# Altium schematic sheet 1_PWR.schdoc
size 210 x 148 mm; Symbol: tv_muban1_1; Company: 嘉立创EDA; Version: V1.0; Page Size: A4; @Project Name: LCEDAsucaiku; @Update Date: 2026-05-01; @Create Date: 2026-03-27; @Page Name: PWR; @Page Count: 8; @Page No: 1; @Update Time: 18:37:05; Color: #990000; Device: sucai_muban; @Board Name: tv基板; @Create Time: 22:33:50; @Schematic Name: Schematic1; @Assembly Variant: Basic; Border: 1; Title Block Position: 3; Size: A4; Width: 826; Height: 582; Region Start: 1; X Region Count: 6; Y Region Count: 4; Blade Width: 10; SheetNumber: 1; SheetTotal: 8
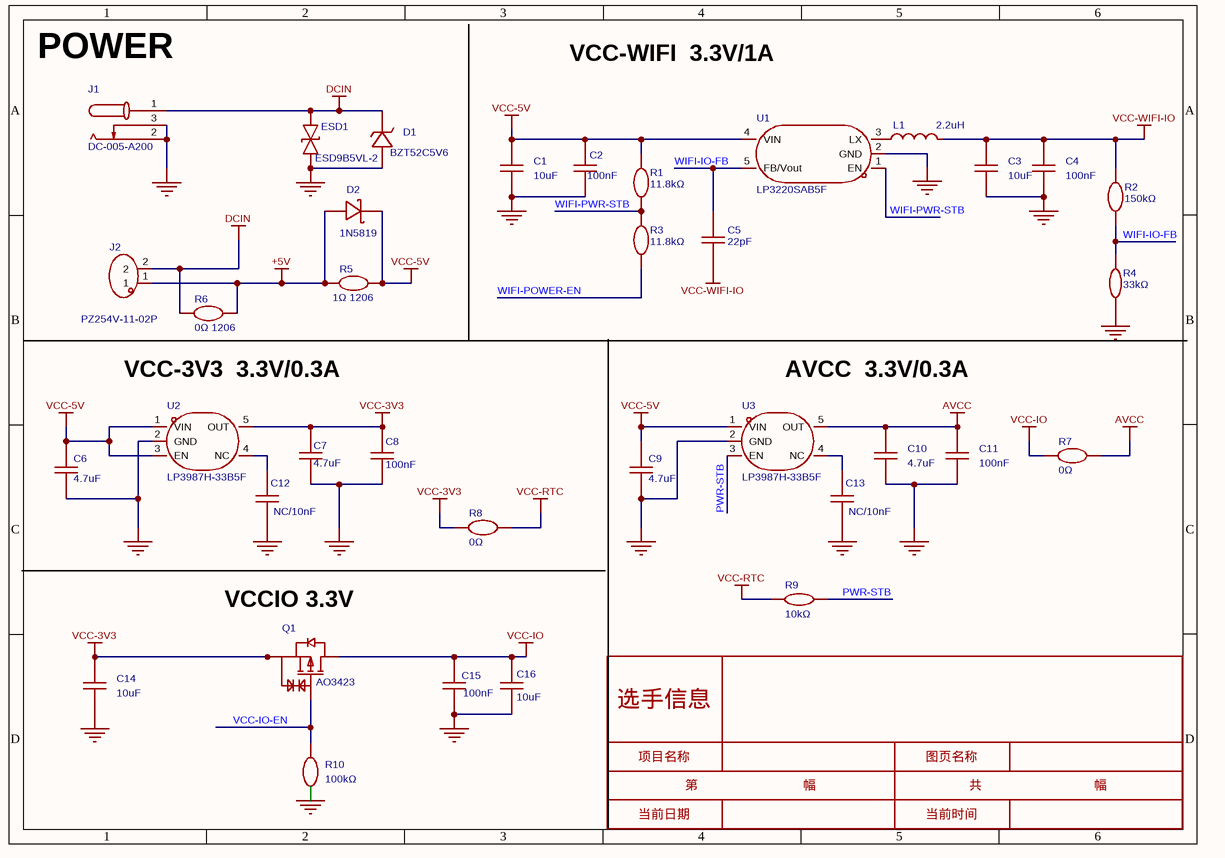
[diagram p0: 1_PWR.schdoc]

## Parts
C1  10uF  [C0805]
C2  100nF  [C0402]
C3  10uF  [C0805]
C4  100nF  [C0402]
C5  22pF  [C0402]
C6  4.7uF  [C0402]
C7  4.7uF  [C0402]
C8  100nF  [C0402]
C9  4.7uF  [C0402]
C10  4.7uF  [C0402]
C11  100nF  [C0402]
C12  NC/10nF  [C0402]
C13  NC/10nF  [C0402]
C14  10uF  [C0805]
C15  100nF  [C0402]
C16  10uF  [C0805]
D1  BZT52C5V6  [SOD-123_L2.7-W1.6-LS3.7-RD]
D2  1N5819  [SMA_L4.4-W2.6-LS5.0-RD]
ESD1  ESD9B5VL-2  [DFN1006-2L-BI]
J1  DC-005-A200  [DC-IN-TH_DC-005-A200]
J2  PZ254V-11-02P  [HDR-TH_2P-P2.54-V-M]
L1  2.2uH  [IND-SMD_L4.6-W4.1_MHCI04015]
Q1  AO3423  [SOT-23-3_L2.9-W1.3-P1.90-LS2.4-BR-3]
R1  11.8kΩ  [R0402]
R2  150kΩ  [R0402]
R3  11.8kΩ  [R0402]
R4  33kΩ  [R0402]
R5  1Ω 1206  [R1206]
R6  0Ω 1206  [R1206]
R7  0Ω  [R0402]
R8  0Ω  [R0402]
R9  10kΩ  [R0402]
R10  100kΩ  [R0402]
U1  LP3220SAB5F  [SOT-23-5_L3.0-W1.7-P0.95-LS2.8-BR]
U2  LP3987H-33B5F  [SOT-23-5_L3.0-W1.7-P0.95-LS2.8-BL]
U3  LP3987H-33B5F  [SOT-23-5_L3.0-W1.7-P0.95-LS2.8-BL]

## Nets
+5V: D2.2(A) J2.1 R5.1 R6.2
AVCC: C10.2 C11.2 R7.2 U3.5(OUT)
DCIN: D1.1(K) ESD1.2 J1.1 J2.2 R6.1
GND: C1.1 C2.1 C3.1 C4.1 C6.1 C7.1 C8.1 C9.1 C10.1 C11.1 C12.1 C13.1 C14.1 C15.1 C16.1 D1.2(A) ESD1.1 J1.2 J1.3 R4.1 R10.2 U1.2(GND) U2.2(GND) U3.2(GND)
VCC-3V3: C7.2 C8.2 C14.2 Q1.2(S) R8.1 U2.5(OUT)
VCC-5V: C1.2 C2.2 C6.2 C9.2 D2.1(C) R1.2 R5.2 U1.4(VIN) U2.1(VIN) U2.3(EN) U3.1(VIN)
VCC-IO: C15.2 C16.2 Q1.3(D) R7.1
VCC-RTC: R8.2 R9.1
VCC-WIFI-IO: C3.2 C4.2 C5.1 L1.2 R2.2
PWR-STB: R9.2 U3.3(EN)
VCC-IO-EN: Q1.1(G) R10.1
WIFI-IO-FB: C5.2 R2.1 R4.2 U1.5(FB/Vout)
WIFI-POWER-EN: R3.1
WIFI-PWR-STB: R1.1 R3.2 U1.1(EN)
NetC12_2: C12.2 U2.4(NC)
NetC13_2: C13.2 U3.4(NC)
NetL1_1: L1.1 U1.3(LX)

## Notes on the sheet
- (near J1) POWER
- VCC-WIFI  3.3V/1A
- VCC-3V3  3.3V/0.3A
- AVCC  3.3V/0.3A
- (near Q1) VCCIO 3.3V
- 选手信息
- 项目名称
- 第                              幅
- 图页名称
- 共                                幅
- 当前日期
- 当前时间

## Library data of the parts
C1 C3 = CGA0805X5R106K500MT: 容值:10uF;精度:±10%;额定电压:50V;温度系数:X5R;; Manufacturer: HRE(芯声); 3D Model: 1ba041120af144c991958decab20d241聨0819f05c4eef4c71ace90d822a990e87; 3D Model Transform: 78.74,51.181,0,0,0,0,0,0.0005,0; Tolerance: ±10%; Voltage Rating: 50V; Temperature Coefficient: X5R; AddInBom: yes; ModelName: C0805_L2.0-W1.3-H1.3; Symbol: CGA0805X5R106K500MT; Device: CGA0805X5R106K500MT; LCSC Part Name: 10uF ±10% 50V; Supplier Part: C6119889; Manufacturer Part: CGA0805X5R106K500MT; Supplier Footprint: 0805; JLCPCB Part Class: Extended Part; Datasheet: https://item.szlcsc.com/datasheet/CGA0805X5R106K500MT/7062595.html; Supplier: LCSC; Value: 10uF; ConvertToPcb: yes; FootprintName: C0805
C2 C4 = CL05B104KO5NNNC: 容值:100nF;精度:±10%;额定电压:16V;温度系数:X7R;; Manufacturer: SAMSUNG(三星); 3D Model: 36a51122f27c49738f86b3bfa98863e0聨0819f05c4eef4c71ace90d822a990e87; 3D Model Transform: 39.37,19.685,0,0,0,0,0,0,0; Tolerance: ±10%; Voltage Rating: 16V; Temperature Coefficient: X7R; AddInBom: yes; ModelName: C0402_L1.0-W0.5-H0.5; Symbol: CL05B104KO5NNNC; Device: CL05B104KO5NNNC; LCSC Part Name: 100nF ±10% 16V; Supplier Part: C1525; Manufacturer Part: CL05B104KO5NNNC; Supplier Footprint: 0402; JLCPCB Part Class: Basic Part; Datasheet: https://item.szlcsc.com/datasheet/CL05B104KO5NNNC/1877.html; Supplier: LCSC; Value: 100nF; ConvertToPcb: yes; FootprintName: C0402
C5 = FCC0402N220J500AT: 容值:22pF;精度:±5%;额定电压:50V;温度系数:C0G;; Manufacturer: FOJAN(富捷); 3D Model: 36a51122f27c49738f86b3bfa98863e0聨0819f05c4eef4c71ace90d822a990e87; 3D Model Transform: 39.37,19.685,0,0,0,0,0,0,0; Tolerance: ±5%; Voltage Rating: 50V; Temperature Coefficient: C0G; AddInBom: yes; ModelName: C0402_L1.0-W0.5-H0.5; Symbol: FCC0402N220J500AT; Device: FCC0402N220J500AT; LCSC Part Name: 22pF ±5% 50V; Supplier Part: C5137569; Manufacturer Part: FCC0402N220J500AT; Supplier Footprint: 0402; JLCPCB Part Class: Extended Part; Datasheet: https://item.szlcsc.com/datasheet/FCC0402N220J500AT/5747021.html; Supplier: LCSC; Value: 22pF; ConvertToPcb: yes; FootprintName: C0402
C6 C7 C9 C10 = GRM155C61E475ME15D: 容值:4.7uF;精度:±20%;额定电压:25V;温度系数:-;; Manufacturer: muRata(村田); AddInBom: yes; ModelId: 36a51122f27c49738f86b3bfa98863e0聨0819f05c4eef4c71ace90d822a990e87; ModelName: C0402_L1.0-W0.5-H0.5; ModelTransform: 39.37,19.685,0,0,0,0,0,0,0; Tolerance: ±20%; Voltage Rating: 25V; Symbol: GRM155C61E475ME15D; Device: GRM155C61E475ME15D; LCSC Part Name: 4.7uF ±20% 25V; SupplierPart: C5718966; ManufacturerPart: GRM155C61E475ME15D; Supplier Footprint: 0402; JLCPCB Part Class: Extended Part; Datasheet: https://item.szlcsc.com/datasheet/GRM155C61E475ME15D/6643118.html; Supplier: LCSC; ConvertToPcb: yes; FootprintName: C0402; Value: 4.7uF; Temperature Coefficient: -
C8 C11-C13 C15 = CL05B104KO5NNNC: 容值:100nF;精度:±10%;额定电压:16V;温度系数:X7R;; Manufacturer: SAMSUNG(三星); AddInBom: yes; ModelId: 36a51122f27c49738f86b3bfa98863e0聨0819f05c4eef4c71ace90d822a990e87; ModelName: C0402_L1.0-W0.5-H0.5; ModelTransform: 39.37,19.685,0,0,0,0,0,0,0; Tolerance: ±10%; Voltage Rating: 16V; Temperature Coefficient: X7R; Symbol: CL05B104KO5NNNC; Device: CL05B104KO5NNNC; LCSC Part Name: 100nF ±10% 16V; ManufacturerPart: CL05B104KO5NNNC; Supplier Footprint: 0402; JLCPCB Part Class: Basic Part; Datasheet: https://item.szlcsc.com/datasheet/CL05B104KO5NNNC/1877.html; Supplier: LCSC; ConvertToPcb: yes; FootprintName: C0402
  C8 C11 C15: SupplierPart: C1525; Value: 100nF
  C12 C13: Value: NC/10nF
C14 C16 = CGA0805X5R106K500MT: 容值:10uF;精度:±10%;额定电压:50V;温度系数:X5R;; Manufacturer: HRE(芯声); AddInBom: yes; ModelId: 1ba041120af144c991958decab20d241聨0819f05c4eef4c71ace90d822a990e87; ModelName: C0805_L2.0-W1.3-H1.3; ModelTransform: 78.74,51.181,0,0,0,0,0,0.0005,0; Tolerance: ±10%; Voltage Rating: 50V; Temperature Coefficient: X5R; Symbol: CGA0805X5R106K500MT; Device: CGA0805X5R106K500MT; LCSC Part Name: 10uF ±10% 50V; SupplierPart: C6119889; ManufacturerPart: CGA0805X5R106K500MT; Supplier Footprint: 0805; JLCPCB Part Class: Extended Part; Datasheet: https://item.szlcsc.com/datasheet/CGA0805X5R106K500MT/7062595.html; Supplier: LCSC; ConvertToPcb: yes; FootprintName: C0805; Value: 10uF
D1 = BZT52C5V6_C19077402: 二极管配置:独立式;稳压值(标称值):5.6V;稳压值(范围):5.32V~5.88V;耗散功率(Pd):350mW;; Manufacturer: R+O(宏嘉诚); AddInBom: yes; ModelId: ad7e39f9e5534b3c96ffdc5532ebb493聨0819f05c4eef4c71ace90d822a990e87; ModelName: SOD-123_L2.7-W1.6-H1.4-LS3.7; ModelTransform: 146.026,62.992,0,180,0,0,0.0005,0,0; Diode Configuration: 独立式; Zener Voltage(Nom): 5.6V; Reverse Leakage Current (Ir): 1uA@2.0V; Pd - Power Dissipation: 350mW; Impedance(Zzt): 40Ω; Impedance(Zzk): 400Ω; Operating Junction Temperature Range: -55℃~+150℃; Symbol: BZT52C5V6_C19077402; Device: BZT52C5V6_C19077402; LCSC Part Name: 表面贴装齐纳二极管; SupplierPart: C19077402; ManufacturerPart: BZT52C5V6; Supplier Footprint: SOD-123; JLCPCB Part Class: Extended Part; Datasheet: https://item.szlcsc.com/datasheet/BZT52C5V6/20275487.html; Supplier: LCSC; ConvertToPcb: yes; FootprintName: SOD-123_L2.7-W1.6-LS3.7-RD; Zener Voltage(Range): 5.32V~5.88V
D2 = 1N5819_C437199: 正向压降(Vf):500mV@1A;直流反向耐压(Vr):40V;整流电流:1A;; Manufacturer: KEXIN(科信); AddInBom: yes; ModelId: a2d22152f8d5421c8e96dbd56af7c345聨0819f05c4eef4c71ace90d822a990e87; ModelTransform: 204.724,98.425,0,0,0,0,0,0,0; Voltage - DC Reverse(Vr): 40V; Current - Rectified: 1A; Operating Junction Temperature Range: -60℃~+125℃; Non-Repetitive Peak Forward Surge Current: 40A; Symbol: 1N5819_C437199; Device: 1N5819_C437199; LCSC Part Name: KEXIN(科信)原型号 SS14,后续变更为 1N5819，丝印不变。 电压:40V 电流:1A; SupplierPart: C437199; ManufacturerPart: 1N5819; Supplier Footprint: DO-214AC(SMA); JLCPCB Part Class: Extended Part; Datasheet: https://item.szlcsc.com/datasheet/1N5819/435098.html; Supplier: LCSC; ConvertToPcb: yes; FootprintName: SMA_L4.4-W2.6-LS5.0-RD; ModelName: SMA_L4.4-W2.6-LS5.0-RD; Voltage - Forward(Vf@If): 500mV@1A
ESD1 = ESD9B5VL-2: 反向截止电压(Vrwm):5V;钳位电压:12.5V;峰值脉冲功率(Ppp):80W@8/20us;击穿电压:6V;; Manufacturer: Leiditech(雷卯电子); AddInBom: yes; ModelId: 2bdbcca3b35b49c5a8ae725a08658930聨0819f05c4eef4c71ace90d822a990e87; ModelTransform: 40.1574,24.4094,0,0,0,0,0,0,0; Reverse Stand-Off Voltage (Vrwm): 5V; Clamping Voltage: 12.5V; Voltage - Breakdown: 6V; Reverse Leakage Current (Ir): 500nA; level of protection: IEC 61000-4-5；IEC 61000-4-2; Junction Capacitance: 15pF; Symbol: ESD9B5VL-2; Device: ESD9B5VL-2; Manufacturer Part: ESD9B5VL-2; LCSC Part Name: ESD 5V截止; SupplierPart: C5144823; Supplier Footprint: DFN1006-2; JLCPCB Part Class: Extended Part; Datasheet: https://item.szlcsc.com/datasheet/ESD9B5VL-2/5766708.html; Supplier: LCSC; ConvertToPcb: yes; FootprintName: DFN1006-2L-BI; ModelName: DFN1006-2L-BI; Peak Pulse Power Dissipation (Ppp): 80W@8/20us; Type: ESD
J1 = DC-005-A200: 连接器类型:DC电源插座;安装方式:弯插;触点内径:2mm;触点外径:6.4mm;额定电流:3A;额定电压:30V;工作温度:-20℃~+70℃;; Manufacturer: XUNPU(讯普); AddInBom: yes; ModelId: 1321cdbe1dc84555a9684967491c8670聨0819f05c4eef4c71ace90d822a990e87; ModelTransform: 553.149,368.14887,0,0,0,0,-137.795,85.63,-161.417; Connector Type: DC电源插座; Inside Contact Diameter: 2mm; Outside Contact Diameter: 6.4mm; Current Rating: 3A; Voltage Rating (Max): 30V; Symbol: DC-005-A200; Device: DC-005-A200; LCSC Part Name: DC电源插座 内径:2mm 外径:6.4mm; SupplierPart: C720557; ManufacturerPart: DC-005-A200; Supplier Footprint: 插件; JLCPCB Part Class: Extended Part; Datasheet: https://item.szlcsc.com/datasheet/DC-005-A200/763564.html; Supplier: LCSC; ConvertToPcb: yes; FootprintName: DC-IN-TH_DC-005-A200; ModelName: DC-IN-TH_DC-005-A200; Mounting Type: 弯插; Operating Temperature: -20℃~+70℃
J2 = PZ254V-11-02P: 插针结构:1x2P;间距:2.54mm;行距:-;圆针/方针:方针;安装方式:直插;排数:单排;总PIN位数:2P;额定电流:3A;额定电压:250V;配合针长度:6mm;塑高:2.5mm;端接针长度:3mm;触头材质:黄铜;触头镀层:-;工作温度:-40℃~+105℃;颜色:黑色;; Manufacturer: XFCN(兴飞); AddInBom: yes; ModelId: e35305ec3aa84b66b849f914b715e73f聨0819f05c4eef4c71ace90d822a990e87; ModelName: HDR2.54-M-LI-1X2P; ModelTransform: 200,100,0,0,0,0,0,0,-118.11; Pin Structure: 1x2P; Pitch: 2.54mm; Circluar Pins/Square Pins: 方针; Current Rating: 3A; Voltage Rating (Max): 250V; Symbol: PZ254V-11-02P; Device: PZ254V-11-02P; LCSC Part Name: 1x2P 间距:2.54mm 方针 直插; SupplierPart: C492401; ManufacturerPart: PZ254V-11-02P; Supplier Footprint: 插件,P=2.54mm; JLCPCB Part Class: Extended Part; Datasheet: https://item.szlcsc.com/datasheet/PZ254V-11-02P/502957.html; Supplier: LCSC; ConvertToPcb: yes; FootprintName: HDR-TH_2P-P2.54-V-M; Row Spacing: -; Mounting Type: 直插; Number of Rows: 单排; Number of Pins: 2P; Length of Mating Pin: 6mm; Insulation Height: 2.5mm; Length of End Connection Pin: 3mm; Contact Material: 黄铜; Contact Plating: -; Operating Temperature: -40℃~+105℃; Color: 黑色
L1 = SRG0420-2R2-M: 电感值:2.2uH;精度:±20%;额定电流:4A;饱和电流(Isat):5A;类型:一体成型电感;; Manufacturer: JIERR(捷而瑞); Tolerance: ±20%; Current Rating: 4A; Current - Saturation(Isat): 5A; DC Resistance(DCR): 49mΩ; Type: 一体成型电感; AddInBom: yes; Symbol: SRG0420-2R2-M; Device: SRG0420-2R2-M; LCSC Part Name: 2.2μH ±20% 5A; Supplier Part: C53462916; Manufacturer Part: SRG0420-2R2-M; Supplier Footprint: SMD,4.6x4.1mm; JLCPCB Part Class: Extended Part; Datasheet: https://item.szlcsc.com/datasheet/SRG0420-2R2-M/56628161.html; Supplier: LCSC; Value: 2.2uH; ConvertToPcb: yes; FootprintName: IND-SMD_L4.6-W4.1_MHCI04015
Q1 = AO3423_C19268144: 漏源电压(Vdss):20V;连续漏极电流(Id):3A;导通电阻(RDS(on)@Vgs,Id):125mΩ@2.5V,2A;功率(Pd):1.55W;阈值电压(Vgs(th)@Id):1.1V@3A;; Manufacturer: TECH PUBLIC(台舟); AddInBom: yes; ModelId: c62791f0466c4ae2a892c056b845b0ca聨0819f05c4eef4c71ace90d822a990e87; ModelName: SOT-23-3P_L2.9-W1.3-H1.0-LS2.4-P0.95; ModelTransform: 98.425,114.173,0,180,0,0,0.0005,-0.0005,0; Drain Source Voltage (Vdss): 20V; Continuous Drain Current (Id): 3A; Power Dissipation (Pd): 1.55W; Input Capacitance (Ciss@Vds): 520pF@16V; Reverse Transfer Capacitance (Crss@Vds): 80pF@16V; Symbol: AO3423_C19268144; Device: AO3423_C19268144; LCSC Part Name: 耐压:20V 电流:3A; SupplierPart: C19268144; ManufacturerPart: AO3423; Supplier Footprint: SOT-23; JLCPCB Part Class: Extended Part; Datasheet: https://atta.szlcsc.com/upload/public/pdf/source/20231201/DEC71D908761248026A69CF2D48D0084.pdf; Supplier: LCSC; ConvertToPcb: yes; FootprintName: SOT-23-3_L2.9-W1.3-P1.90-LS2.4-BR-3; Drain Source On Resistance (RDS(on)@Vgs,Id): 125mΩ@2.5V,2A; Gate Threshold Voltage (Vgs(th)@Id): 1.1V@3A; Operating Temperature: -55℃~+150℃
R1 R3 = FRC0402F1182TS: 电阻类型:厚膜电阻;阻值:11.8kΩ;精度:±1%;功率:62.5mW;工作电压:50V;温度系数:±100ppm/℃;; Manufacturer: FOJAN(富捷); 3D Model: 98c88bc2b9094f218f3a3e30a7012738聨0819f05c4eef4c71ace90d822a990e87; 3D Model Transform: 39.37,19.685,0,0,0,0,0,0,0; Tolerance: ±1%; Power(Watts): 62.5mW; Voltage-Supply(Max): 50V; AddInBom: yes; ModelName: R0402_L1.0-W0.5-H0.4; Symbol: FRC0402F1182TS; Device: FRC0402F1182TS; LCSC Part Name: 11.8kΩ ±1% 62.5mW 厚膜电阻; Supplier Part: C2929934; Manufacturer Part: FRC0402F1182TS; Supplier Footprint: 0402; JLCPCB Part Class: Extended Part; Supplier: LCSC; Type: 厚膜电阻; Value: 11.8kΩ; Temperature Coefficient: ±100ppm/℃; Operating Temperature: -55℃~+155℃; ConvertToPcb: yes; FootprintName: R0402
R2 = FRC0402F1503TS: 电阻类型:厚膜电阻;阻值:150kΩ;精度:±1%;功率:62.5mW;工作电压:50V;温度系数:±100ppm/℃;; Manufacturer: FOJAN(富捷); 3D Model: 98c88bc2b9094f218f3a3e30a7012738聨0819f05c4eef4c71ace90d822a990e87; 3D Model Transform: 39.37,19.685,0,0,0,0,0,0,0; Tolerance: ±1%; Power(Watts): 62.5mW; Voltage-Supply(Max): 50V; AddInBom: yes; ModelName: R0402_L1.0-W0.5-H0.4; Symbol: FRC0402F1503TS; Device: FRC0402F1503TS; LCSC Part Name: 150kΩ ±1% 62.5mW 厚膜电阻; Supplier Part: C2909320; Manufacturer Part: FRC0402F1503TS; Supplier Footprint: 0402; JLCPCB Part Class: Extended Part; Supplier: LCSC; Type: 厚膜电阻; Value: 150kΩ; Temperature Coefficient: ±100ppm/℃; Operating Temperature: -55℃~+155℃; ConvertToPcb: yes; FootprintName: R0402
R4 = 0402WGF3302TCE: 电阻类型:厚膜电阻;阻值:33kΩ;精度:±1%;功率:62.5mW;最大工作电压:50V;温度系数:±100ppm/℃;; Manufacturer: UNI-ROYAL(厚声); 3D Model: 98c88bc2b9094f218f3a3e30a7012738聨0819f05c4eef4c71ace90d822a990e87; 3D Model Transform: 39.37,19.685,0,0,0,0,0,0,0; Tolerance: ±1%; Power(Watts): 62.5mW; Overload Voltage (Max): 50V; AddInBom: yes; ModelName: R0402_L1.0-W0.5-H0.4; Symbol: 0402WGF3302TCE; Device: 0402WGF3302TCE; LCSC Part Name: 33kΩ ±1% 62.5mW 厚膜电阻; Supplier Part: C25779; Manufacturer Part: 0402WGF3302TCE; Supplier Footprint: 0402; JLCPCB Part Class: Basic Part; Datasheet: https://atta.szlcsc.com/upload/public/pdf/source/20200306/C422600_1E6D84923E4A46A82E41ADD87F860B5C.pdf; Supplier: LCSC; Type: 厚膜电阻; Value: 33kΩ; Temperature Coefficient: ±100ppm/℃; Operating Temperature Range: -55℃~+155℃; ConvertToPcb: yes; FootprintName: R0402
R5 = FRC1206J1R0 TS: 电阻类型:厚膜电阻;阻值:1Ω;精度:±5%;功率:250mW;工作电压:200V;温度系数:±200ppm/℃;; Manufacturer: FOJAN(富捷); AddInBom: yes; ModelId: 89a1f13db2384da588040e0b3c55bf66聨0819f05c4eef4c71ace90d822a990e87; ModelName: R1206_L3.2-W1.6-H0.6; ModelTransform: 125.984,62.992,0,0,0,0,0,0,0; Tolerance: ±5%; Power(Watts): 250mW; Voltage-Supply(Max): 200V; Symbol: FRC1206J1R0 TS; Device: FRC1206J1R0 TS; Value: 1Ω 1206; LCSC Part Name: 1Ω ±5% 250mW 厚膜电阻; ManufacturerPart: FRC1206J1R0 TS; Supplier Footprint: 1206; JLCPCB Part Class: Extended Part; Datasheet: https://item.szlcsc.com/datasheet/FRC1206J1R0%2520TS/3180955.html; Supplier: LCSC; ConvertToPcb: yes; FootprintName: R1206; Type: 厚膜电阻; Temperature Coefficient: ±200ppm/℃; Operating Temperature: -55℃~+155℃
R6 = FRC1206P000 TS: 电阻类型:厚膜电阻;阻值:0Ω;精度:±5%;功率:250mW;工作电压:200V;; Manufacturer: FOJAN(富捷); AddInBom: yes; ModelId: 89a1f13db2384da588040e0b3c55bf66聨0819f05c4eef4c71ace90d822a990e87; ModelName: R1206_L3.2-W1.6-H0.6; ModelTransform: 125.984,62.992,0,0,0,0,0,0,0; Tolerance: ±5%; Power(Watts): 250mW; Voltage-Supply(Max): 200V; Symbol: FRC1206P000 TS; Device: FRC1206P000 TS; Value: 0Ω 1206; LCSC Part Name: 0Ω ±5% 250mW 厚膜电阻; ManufacturerPart: FRC1206P000 TS; Supplier Footprint: 1206; JLCPCB Part Class: Extended Part; Supplier: LCSC; ConvertToPcb: yes; FootprintName: R1206; Type: 厚膜电阻; Operating Temperature: -55℃~+155℃
R7 R8 = FRC0402P000 TS: 电阻类型:厚膜电阻;阻值:0Ω;精度:±5%;功率:62.5mW;工作电压:50V;; Manufacturer: FOJAN(富捷); AddInBom: yes; ModelId: 98c88bc2b9094f218f3a3e30a7012738聨0819f05c4eef4c71ace90d822a990e87; ModelName: R0402_L1.0-W0.5-H0.4; ModelTransform: 39.37,19.685,0,0,0,0,0,0,0; Tolerance: ±5%; Power(Watts): 62.5mW; Voltage-Supply(Max): 50V; Symbol: FRC0402P000 TS; Device: FRC0402P000 TS; LCSC Part Name: 0Ω ±5% 62.5mW 厚膜电阻; SupplierPart: C2906877; ManufacturerPart: FRC0402P000 TS; Supplier Footprint: 0402; JLCPCB Part Class: Extended Part; Supplier: LCSC; ConvertToPcb: yes; FootprintName: R0402; Type: 厚膜电阻; Value: 0Ω; Operating Temperature: -55℃~+155℃
R9 = RC0402FR-0710KL: 电阻类型:厚膜电阻;阻值:10kΩ;精度:±1%;功率:62.5mW;工作电压:50V;温度系数:±100ppm/℃;; Manufacturer: YAGEO(国巨); AddInBom: yes; ModelId: 98c88bc2b9094f218f3a3e30a7012738聨0819f05c4eef4c71ace90d822a990e87; ModelName: R0402_L1.0-W0.5-H0.4; ModelTransform: 39.37,19.685,0,0,0,0,0,0,0; Tolerance: ±1%; Power(Watts): 62.5mW; Voltage-Supply(Max): 50V; Symbol: RC0402FR-0710KL; Device: RC0402FR-0710KL; LCSC Part Name: 厚膜电阻 10kΩ ±1% 62.5mW; SupplierPart: C60490; ManufacturerPart: RC0402FR-0710KL; Supplier Footprint: 0402; JLCPCB Part Class: Extended Part; Datasheet: https://item.szlcsc.com/datasheet/RC0402FR-0710KL/61542.html; Supplier: LCSC; ConvertToPcb: yes; FootprintName: R0402; Type: 厚膜电阻; Value: 10kΩ; Temperature Coefficient: ±100ppm/℃; Operating Temperature: -55℃~+155℃
R10 = RT0402BRD07100KL: 电阻类型:薄膜电阻;阻值:100kΩ;精度:±0.1%;功率:62.5mW;最大工作电压:50V;温度系数:±25ppm/℃;; Manufacturer: YAGEO(国巨); AddInBom: yes; ModelId: 98c88bc2b9094f218f3a3e30a7012738聨0819f05c4eef4c71ace90d822a990e87; ModelName: R0402_L1.0-W0.5-H0.4; ModelTransform: 39.37,19.685,0,0,0,0,0,0,0; Tolerance: ±0.1%; Power(Watts): 62.5mW; Overload Voltage (Max): 50V; Symbol: RT0402BRD07100KL; Device: RT0402BRD07100KL; LCSC Part Name: 薄膜电阻 100kΩ ±0.1% 62.5mW; SupplierPart: C852472; ManufacturerPart: RT0402BRD07100KL; Supplier Footprint: 0402; JLCPCB Part Class: Extended Part; Datasheet: https://atta.szlcsc.com/upload/public/pdf/source/20210326/C852472_6283D268A9C33EA67274729CC55E28B1.pdf; Supplier: LCSC; ConvertToPcb: yes; FootprintName: R0402; Type: 薄膜电阻; Value: 100kΩ; Temperature Coefficient: ±25ppm/℃; Operating Temperature Range: -55℃~+155℃
U1 = LP3220SAB5F: 功能类型:降压型;工作电压:2.2V~5.5V;输出电压:610mV~5.5V;输出电流:1A;输出类型:可调;; Manufacturer: LOWPOWER(微源半导体); 3D Model: 0a2a1b8f50944f73965918ad6e5fe167聨0819f05c4eef4c71ace90d822a990e87; 3D Model Transform: 114.173,109.636,0,180,0,0,0,0,0; Function: 降压型; Output Current: 1A; Frequency - Switching: 1.5MHz; Synchronous Rectifier: 是; Number of Outputs: 1; Topology: 降压式; Quiescent Current: 70uA; Switch tube (built-in/external): 内置; Output Type: 可调; AddInBom: yes; ModelName: SOT-23-5_L2.9-W1.6-H1.1-LS2.8-P0.95; Symbol: LP3220SAB5F; Device: LP3220SAB5F; LCSC Part Name: 1.5MHz 1.0A 降压转换器; Supplier Part: C517212; Manufacturer Part: LP3220SAB5F; Supplier Footprint: SOT-23-5; JLCPCB Part Class: Extended Part; Datasheet: https://item.szlcsc.com/datasheet/LP3220SAB5F/533577.html; Supplier: LCSC; Voltage - Supply: 2.2V~5.5V; Output Voltage: 610mV~5.5V; Operating Temperature: -40℃~+85℃@(TA); ConvertToPcb: yes; FootprintName: SOT-23-5_L3.0-W1.7-P0.95-LS2.8-BR
U2 U3 = LP3987H-33B5F: 输出类型:固定;工作电压:6V;输出电压:3.3V;输出电流:600mA;电源纹波抑制比(PSRR):65dB@(1kHz);输出极性:正极;; Manufacturer: LOWPOWER(微源半导体); AddInBom: yes; ModelId: 0a2a1b8f50944f73965918ad6e5fe167聨0819f05c4eef4c71ace90d822a990e87; ModelName: SOT-23-5_L2.9-W1.6-H1.1-LS2.8-P0.95; ModelTransform: 118.60433,114.173,0,90,0,0,0.0005,0.0005,0; Output Type: 固定; Voltage - Supply: 6V; Output Voltage: 3.3V; Output Current: 600mA; Voltage Dropout: 480mV@(600mA); standby current: 130uA; Noise: 100uVrms; Output Configuration: 正极; Number of Outputs: 1; Symbol: LP3987H-33B5F; Device: LP3987H-33B5F; LCSC Part Name: 600mA，超低噪声、超快速CMOS低压差线性稳压器; SupplierPart: C517256; ManufacturerPart: LP3987H-33B5F; Supplier Footprint: SOT-23-5; JLCPCB Part Class: Extended Part; Datasheet: https://item.szlcsc.com/datasheet/LP3987H-33B5F/533621.html; Supplier: LCSC; ConvertToPcb: yes; FootprintName: SOT-23-5_L3.0-W1.7-P0.95-LS2.8-BL; Power Supply Rejection Ratio (PSRR): 65dB@(1kHz); Features: 带使能；过热保护；过流保护; Operating Temperature: -40℃~+125℃@(Tj)